# EAGLE schematic schematic_slave1_ammonia (EAGLE 9.6.2)
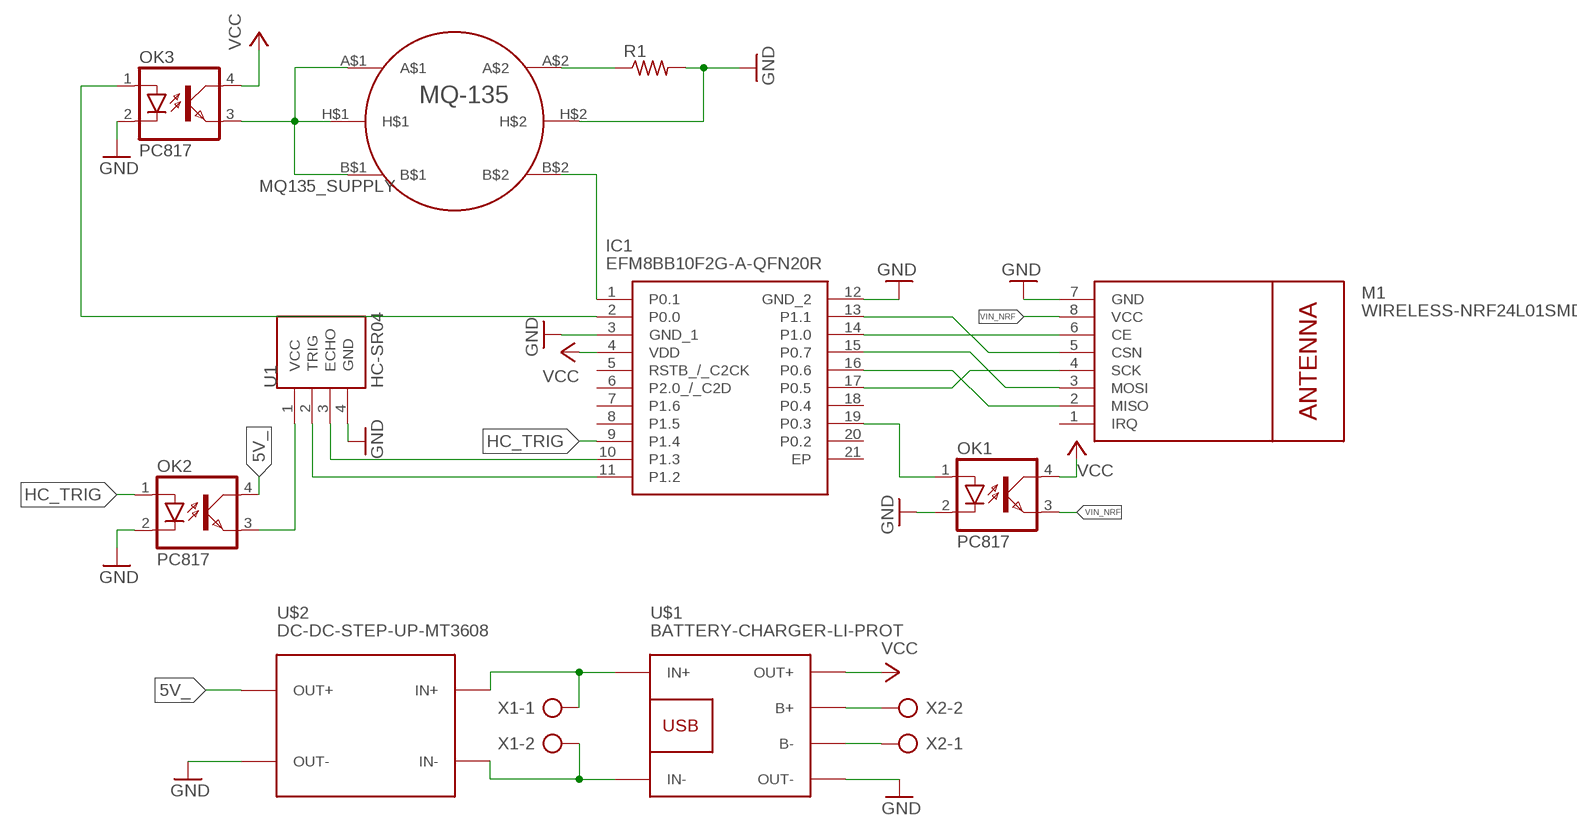
[diagram p0: schematic, sheet 1]

## Parts
IC1  EFM8BB10F2G-A-QFN20R  [EFM8BB10F2GAQFN20R]
M1  WIRELESS-NRF24L01SMD  [WIRELESS-NRF24L01-SMD]
OK1  PC817  [DIL04]
OK2  PC817  [DIL04]
OK3  PC817  [DIL04]
R1  R-US_R0805  [R0805]
U1  HC-SR04  [XCVR_HC-SR04]
U$1  BATTERY-CHARGER-LI-PROT  [BATTERY-CHARGER-LI-PROT]
U$2  DC-DC-STEP-UP-MT3608  [DC-DC-STEP-UP-MT3608]
U$3  MQ_135_A  [MQ-135]
X1  AK500/2-H  [AK500/2-H]
X2  AK500/2-H  [AK500/2-H]

## Nets
5V_: OK2.4(COL) U$2.OUT+
GND: IC1.3(GND_1) IC1.12(GND_2) M1.7(GND) OK1.2(C) OK2.2(C) OK3.2(C) R1.2 U1.4(GND) U$1.OUT- U$2.OUT- U$3.H$2
HC_TRIG: IC1.2(P0.0) IC1.9(P1.4) OK2.1(A) OK3.1(A)
IN+: U$1.IN+ U$2.IN+ X1.1
IN-: U$1.IN- U$2.IN- X1.2
MQ135_SUPPLY: OK3.3(EMIT) U$3.A$1 U$3.B$1 U$3.H$1
N$1: U$1.B+ X2.2
N$2: U$1.B- X2.1
N$3: IC1.17(P0.5) M1.4(SCK)
N$4: IC1.16(P0.6) M1.2(MISO)
N$5: IC1.15(P0.7) M1.3(MOSI)
N$6: IC1.14(P1.0) M1.6(CE)
N$7: IC1.13(P1.1) M1.5(CSN)
N$8: IC1.19(P0.3) OK1.1(A)
N$9: OK2.3(EMIT) U1.1(VCC)
N$10: IC1.11(P1.2) U1.2(TRIG)
N$11: IC1.10(P1.3) U1.3(ECHO)
N$13: R1.1 U$3.A$2
N$14: IC1.1(P0.1) U$3.B$2
VCC: IC1.4(VDD) OK1.4(COL) OK3.4(COL) U$1.OUT+
VIN_NRF: M1.8(VCC) OK1.3(EMIT)
Unconnected: IC1.5(RSTB_/_C2CK) IC1.6(P2.0_/_C2D) IC1.7(P1.6) IC1.8(P1.5) IC1.18(P0.4) IC1.20(P0.2) IC1.21(EP) M1.1(IRQ)

## Library data of the parts
IC1 = SamacSys_Parts:EFM8BB10F2G-A-QFN20R: 8-bit Microcontrollers - MCU 8051 25 MHz 2 kB fla sh 0.25 kB RAM 8-bi Source: Datasheet <https://www.silabs.com/documents/public/data-sheets/efm8bb1-datasheet.pdf>; DESCRIPTION: 8-bit Microcontrollers - MCU 8051 25 MHz 2 kB fla sh 0.25 kB RAM 8-bi; HEIGHT: 0.8mm; MANUFACTURER_NAME: Silicon Labs; MANUFACTURER_PART_NUMBER: EFM8BB10F2G-A-QFN20R; MOUSER_PART_NUMBER: 634-8BB10F2GAQF20R; MOUSER_PRICE-STOCK: https://www.mouser.co.uk/ProductDetail/Silicon-Labs/EFM8BB10F2G-A-QFN20R?qs=DCjbIwhU0ZtADu%252B55HsWtA%3D%3D
M1 = nrf24l01plus:WIRELESS-NRF24L01: 2.4 GHz Wireless Module based on NRF24L01 chip
OK1-OK3 = optocoupler:PC817: SHARP OPTO COUPLER; MPN: PC817X4J000F; OC_FARNELL: 9707727; OC_NEWARK: 97K7059
R1 = rcl:R-US_: RESISTOR, American symbol; SPICEPREFIX: R
U1 = HC-SR04:HC-SR04: Ultrasonic Sensor Module Check availability <https://pricing.snapeda.com/parts/HC-SR04/SparkFun%20Electronics/view-part?ref=eda>; AVAILABILITY: In Stock; DESCRIPTION: HC-SR04 Ultrasonic Sensor Qwiic Platform Evaluation Expansion Board; MF: SparkFun Electronics; MP: HC-SR04; PACKAGE: None; PRICE: None; PURCHASE-URL: https://pricing.snapeda.com/search/part/HC-SR04/?ref=eda
U$1 = diy-modules_1:BATTERY-CHARGER-LI-PROT: Lithium Battery 5V Charger with protection circuit More details available here: http://www.instructables.com/id/DIY-Lithium-ion-Battery-Charger/step4/TP4056-based-lithium-ion-battery-charger-module/ Click here to find device on ebay.com <http://www.ebay.com/sch/tp4056+charger+usb+protection>
U$2 = diy-modules_1:DC-DC-STEP-UP-MT3608: DC/DC Step-Up Regulator based on MT3608 chip MT3608 datasheet available here: https://www.olimex.com/Products/Breadboarding/BB-PWR-3608/resources/MT3608.pdf Click here to find device on ebay.com <http://www.ebay.com/sch/mt3608+module>
U$3 = MQ135:MQ_135_A
X1 X2 = con-ptr500:AK500/2-H: CONNECTOR Aug. 2004 / PTR Meßtechnik: Die Bezeichnung der Serie AK505 wurde geändert. Es handelt sich hierbei um AK500 in horizontaler Ausführung.; OC_FARNELL: unknown; OC_NEWARK: unknown

## Net classes
0 default: width 0.305 mm